# Altium schematic sheet Test Pour Over 1.SchDoc
size Tabloid; SheetNumber: 1; SheetTotal: 1; ENG_APP_DATE: --/--/--; DSN_APP_DATE: --/--/--; CHK_APP_DATE: --/--/--
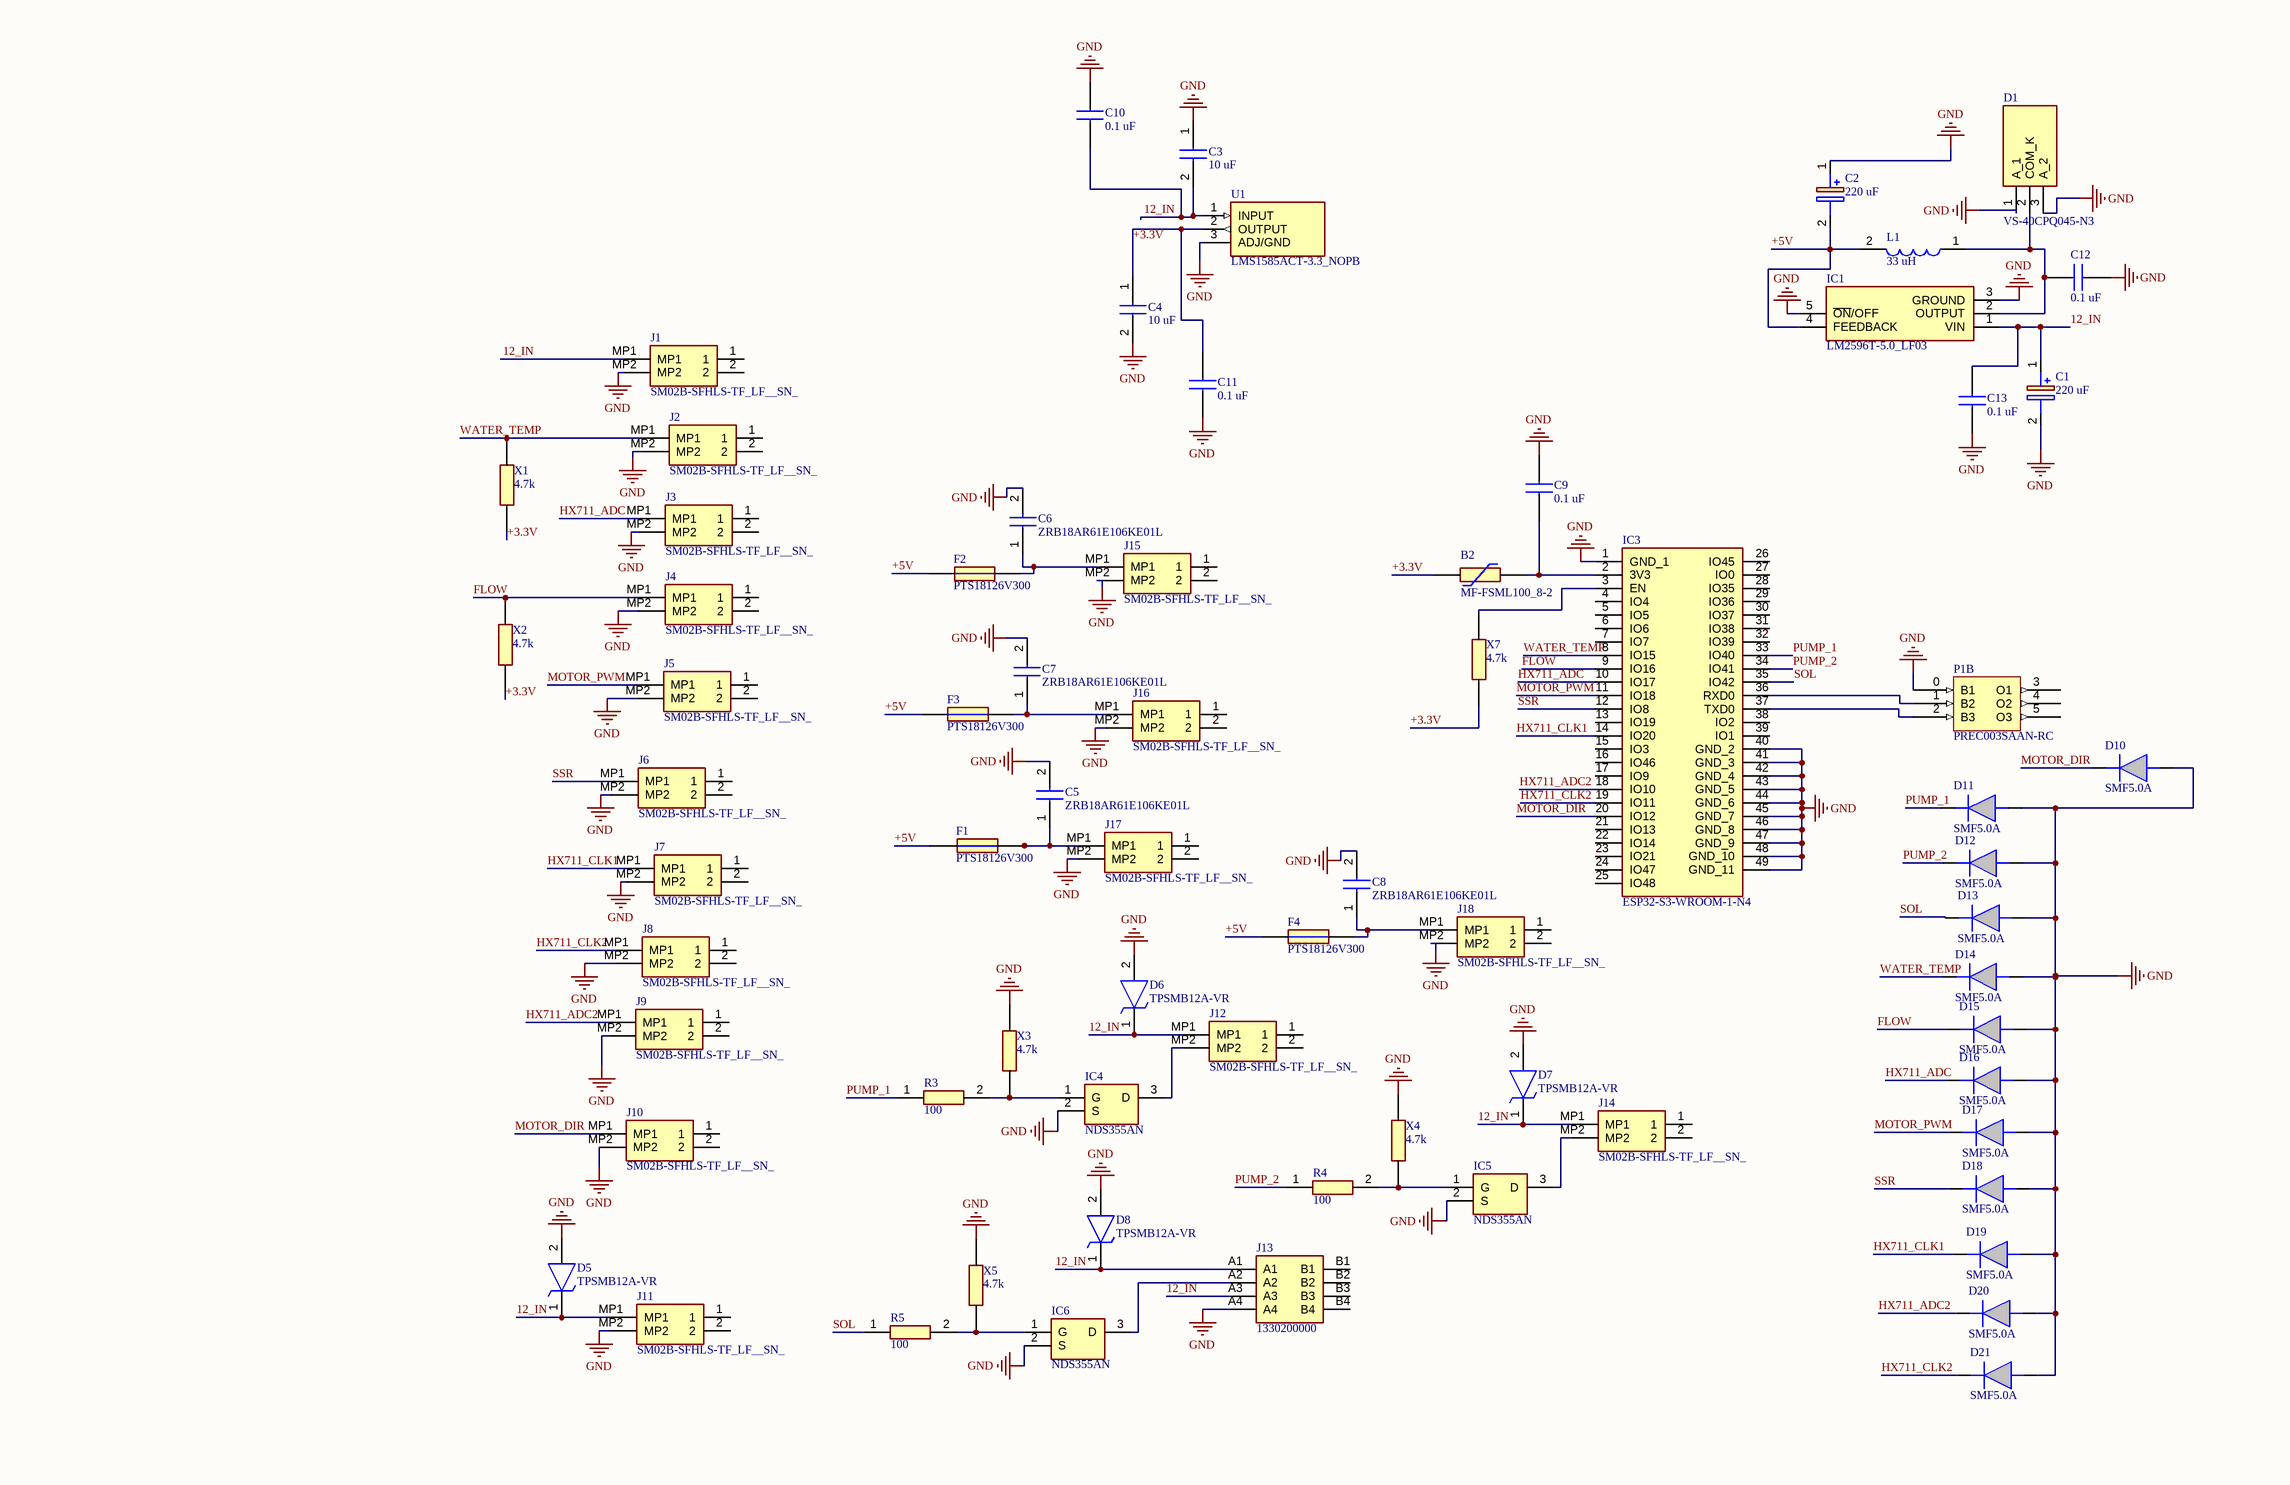
[diagram p0: Test Pour Over 1.SchDoc]

## Parts
B2  MF-FSML100_8-2  [FUSC1608X70N]
C1  220 uF  [EEHZT1E331UP]
C2  220 uF  [EEHZT1E331UP]
C3  10 uF  [ZRB18x]
C4  10 uF  [ZRB18x]
C5  ZRB18AR61E106KE01L  [ZRB18x]
C6  ZRB18AR61E106KE01L  [ZRB18x]
C7  ZRB18AR61E106KE01L  [ZRB18x]
C8  ZRB18AR61E106KE01L  [ZRB18x]
C9  0.1 uF  [CAPC2012X125N]
C10  0.1 uF  [CAPC2012X125N]
C11  0.1 uF  [CAPC2012X125N]
C12  0.1 uF  [CAPC2012X125N]
C13  0.1 uF  [CAPC2012X125N]
D1  VS-40CPQ045-N3  [TO546P531X1558X2499-3P]
D5  TPSMB12A-VR  [DIOM5436X244N]
D6  TPSMB12A-VR  [DIOM5436X244N]
D7  TPSMB12A-VR  [DIOM5436X244N]
D8  TPSMB12A-VR  [DIOM5436X244N]
D10  SMF5.0A  [SODFL3618X110N]
D11  SMF5.0A  [SODFL3618X110N]
D12  SMF5.0A  [SODFL3618X110N]
D13  SMF5.0A  [SODFL3618X110N]
D14  SMF5.0A  [SODFL3618X110N]
D15  SMF5.0A  [SODFL3618X110N]
D16  SMF5.0A  [SODFL3618X110N]
D17  SMF5.0A  [SODFL3618X110N]
D18  SMF5.0A  [SODFL3618X110N]
D19  SMF5.0A  [SODFL3618X110N]
D20  SMF5.0A  [SODFL3618X110N]
D21  SMF5.0A  [SODFL3618X110N]
F1  PTS18126V300  [FUSC4632X120N]
F2  PTS18126V300  [FUSC4632X120N]
F3  PTS18126V300  [FUSC4632X120N]
F4  PTS18126V300  [FUSC4632X120N]
IC1  LM2596T-5.0_LF03  [TO170P470X1028X2142-5P]
IC3  ESP32-S3-WROOM-1-N4  [ESP32S3WROOM1N4]
IC4  NDS355AN  [SOT95P251X112-3N]
IC5  NDS355AN  [SOT95P251X112-3N]
IC6  NDS355AN  [SOT95P251X112-3N]
J1  SM02B-SFHLS-TF_LF__SN_  [SM02BSFHLSTFLFSN]
J2  SM02B-SFHLS-TF_LF__SN_  [SM02BSFHLSTFLFSN]
J3  SM02B-SFHLS-TF_LF__SN_  [SM02BSFHLSTFLFSN]
J4  SM02B-SFHLS-TF_LF__SN_  [SM02BSFHLSTFLFSN]
J5  SM02B-SFHLS-TF_LF__SN_  [SM02BSFHLSTFLFSN]
J6  SM02B-SFHLS-TF_LF__SN_  [SM02BSFHLSTFLFSN]
J7  SM02B-SFHLS-TF_LF__SN_  [SM02BSFHLSTFLFSN]
J8  SM02B-SFHLS-TF_LF__SN_  [SM02BSFHLSTFLFSN]
J9  SM02B-SFHLS-TF_LF__SN_  [SM02BSFHLSTFLFSN]
J10  SM02B-SFHLS-TF_LF__SN_  [SM02BSFHLSTFLFSN]
J11  SM02B-SFHLS-TF_LF__SN_  [SM02BSFHLSTFLFSN]
J12  SM02B-SFHLS-TF_LF__SN_  [SM02BSFHLSTFLFSN]
J13  1330200000  [1330200000]
J14  SM02B-SFHLS-TF_LF__SN_  [SM02BSFHLSTFLFSN]
J15  SM02B-SFHLS-TF_LF__SN_  [SM02BSFHLSTFLFSN]
J16  SM02B-SFHLS-TF_LF__SN_  [SM02BSFHLSTFLFSN]
J17  SM02B-SFHLS-TF_LF__SN_  [SM02BSFHLSTFLFSN]
J18  SM02B-SFHLS-TF_LF__SN_  [SM02BSFHLSTFLFSN]
L1  33 uH  [INDPM8680X400N]
P1  PREC003SAAN-RC  [PCBComponent_1]  (part B of 2)
R3  100  [RESC2012X55N]
R4  100  [RESC2012X55N]
R5  100  [RESC2012X55N]
U1  LMS1585ACT-3.3_NOPB  [TO254P470X1028X1955-3P]
X1  4.7k  [RESC2012X65N]
X2  4.7k  [RESC2012X65N]
X3  4.7k  [RESC2012X65N]
X4  4.7k  [RESC2012X65N]
X5  4.7k  [RESC2012X65N]
X7  4.7k  [RESC2012X65N]

## Nets
GND: C1.2(-) C2.1(+) C3.1 C4.2 C5.2 C6.2 C7.2 C8.2 C9.1 C10.2 C11.1 C12.2 C13.1 D1.1(A_1) D1.3(A_2) D5.2(A) D6.2(A) D7.2(A) D8.2(A) D10.2(A) D11.2(A) D12.2(A) D13.2(A) D14.2(A) D15.2(A) D16.2(A) D17.2(A) D18.2(A) D19.2(A) D20.2(A) D21.2(A) IC1.3(GROUND) IC1.5(~{ON}/OFF) IC3.1(GND_1) IC3.40(GND_2) IC3.41(GND_3) IC3.42(GND_4) IC3.43(GND_5) IC3.44(GND_6) IC3.45(GND_7) IC3.46(GND_8) IC3.47(GND_9) IC3.48(GND_10) IC3.49(GND_11) IC4.2(S) IC5.2(S) IC6.2(S) J1.MP2 J2.MP2 J3.MP2 J4.MP2 J5.MP2 J6.MP2 J7.MP2 J8.MP2 J9.MP2 J10.MP2 J11.MP2 J13.A4 J15.MP2 J16.MP2 J17.MP2 J18.MP2 P1.0(B1) U1.3(ADJ/GND) X3.2 X4.2 X5.2
12_IN: C1.1(+) C3.2 C10.1 C13.2 D5.1(K) D6.1(K) D7.1(K) D8.1(K) IC1.1(VIN) J1.MP1 J11.MP1 J12.MP1 J13.A1 J13.A3 J14.MP1 U1.1(INPUT)
+3.3V: B2.1 C4.1 C11.2 U1.2(OUTPUT) X1.2 X2.2 X7.2
+5V: C2.2(-) F1.1 F2.1 F3.1 F4.1 IC1.4(FEEDBACK) L1.2
FLOW: D15.1(K) IC3.9(IO16) J4.MP1 X2.1
HX711_ADC: D16.1(K) IC3.10(IO17) J3.MP1
HX711_ADC2: D20.1(K) IC3.18(IO10) J9.MP1
HX711_CLK1: D19.1(K) IC3.14(IO20) J7.MP1
HX711_CLK2: D21.1(K) IC3.19(IO11) J8.MP1
MOTOR_DIR: D10.1(K) IC3.20(IO12) J10.MP1
MOTOR_PWM: D17.1(K) IC3.11(IO18) J5.MP1
PUMP_1: D11.1(K) IC3.33(IO40) R3.1
PUMP_2: D12.1(K) IC3.34(IO41) R4.1
SOL: D13.1(K) IC3.35(IO42) R5.1
SSR: D18.1(K) IC3.12(IO8) J6.MP1
WATER_TEMP: D14.1(K) IC3.8(IO15) J2.MP1 X1.1
NetB2_2: B2.2 C9.2 IC3.2(3V3)
NetC5_1: C5.1 F1.2 J17.MP1
NetC6_1: C6.1 F2.2 J15.MP1
NetC7_1: C7.1 F3.2 J16.MP1
NetC8_1: C8.1 F4.2 J18.MP1
NetC12_1: C12.1 D1.2(COM_K) IC1.2(OUTPUT) L1.1
NetIC3_3: IC3.3(EN) X7.1
NetIC3_36: IC3.36(RXD0) P1.1(B2)
NetIC3_37: IC3.37(TXD0) P1.2(B3)
NetIC4_1: IC4.1(G) R3.2 X3.1
NetIC4_3: IC4.3(D) J12.MP2
NetIC5_1: IC5.1(G) R4.2 X4.1
NetIC5_3: IC5.3(D) J14.MP2
NetIC6_1: IC6.1(G) R5.2 X5.1
NetIC6_3: IC6.3(D) J13.A2

Not connected (* = marked no-connect by the designer): IC3 4(IO4) 5(IO5) 6(IO6) 7(IO7) 13(IO19) 15(IO3) 16(IO46) 17(IO9) 21(IO13) 22(IO14) 23(IO21) 24(IO47) 25(IO48) 26(IO45) 27(IO0) 28(IO35) 29(IO36) 30(IO37) 31(IO38) 32(IO39) 38(IO2) 39(IO1); J1 1 2; J2 1 2; J3 1 2; J4 1 2; J5 1 2; J6 1 2; J7 1 2; J8 1 2; J9 1 2; J10 1 2; J11 1 2; J12 1 2; J13 B1 B2 B3 B4; J14 1 2; J15 1 2; J16 1 2; J17 1 2; J18 1 2; P1 3(O1) 4(O2) 5(O3)

## Notes on the sheet
- DWG. NO.
- REV.
- SHT.
- THIS DOCUMENT AND THE DATA DISCLOSED HEREIN OR HEREWITH IS THE PROPERTY OF ALTIUM LIMITED AND MAY BE FREELY DISTRIBUTED IN WHOLE. NO RIGHTS ARE RESERVED OR EXPRESS OR IMPLIED WARANTEE GIVEN.
- REVISION
- DESCRIPTION
- DATE
- APPROVED
- ENG:
- APPROVALS
- PROJECT
- DSN:
- CHK:
- REFERENCE DOCUMENTS
- PROJECT REVISION:
- TITLE
- DOCUMENT REVISION:
- DESIGN ITEM:
- BOM:
- FAB DWG:
- PCB DWG:
- ASSY DWG:
- SCALE:
- SIZE
- B
- CAGE CODE
- FILE NAME
- DWG NO.
- SHEET
- OF
- REV

## Library data of the parts
B2 = MF-FSML100_8-2: Resettable Fuses - PPTC 8V     1A; Manufacturer_Name: Bourns; Manufacturer_Part_Number: MF-FSML100/8-2; Geometry.Height: 0.7mm; Mouser Part Number: 652-MF-FSML100/8-2; Mouser Price/Stock: https://www.mouser.co.uk/ProductDetail/Bourns/MF-FSML100-8-2?qs=EBDBlbfErPzIwKpEUXHByQ%3D%3D; Datasheet Link: https://www.mouser.in/datasheet/2/54/bourns_05032019_MF-FSML-X_datasheet-1591429.pdf
C1 C2 = EEE-TP1C221AP: Capacitor Polarised; Manufacturer_Name: Panasonic; Datasheet Link: http://industrial.panasonic.com/cdbs/www-data/pdf/RDE0000/ABA0000C1196.pdf; Height: 10.8mm; Manufacturer_Part_Number: EEE-TP1C221AP; Mouser Part Number: 667-EEE-TP1C221AP; Mouser Price/Stock: https://www.mouser.com/Search/Refine.aspx?Keyword=667-EEE-TP1C221AP
C3 C4 = ZRB18AR61E106KE01L: Manufacturer_Name: Murata Electronics; Datasheet Link: https://search.murata.co.jp/Ceramy/image/img/A01X/G101/ENG/ZRB18AR61E106KE01-02A.pdf; Height: 1.2mm; Manufacturer_Part_Number: ZRB18AR61E106KE01L
C5-C8 = ZRB18AR61E106KE01L: Capacitor; Manufacturer_Name: Murata Electronics; Datasheet Link: https://search.murata.co.jp/Ceramy/image/img/A01X/G101/ENG/ZRB18AR61E106KE01-02A.pdf; Height: 1.2mm; Manufacturer_Part_Number: ZRB18AR61E106KE01L
C9-C13 = 885382207007: WCAP-CSST Soft Termination MLCC X7R0805104K050DFCT1S000; SMT Chip; 100 nF +/- 10%; 50 V(DC); -55C / +125C; size 0805; LxWxH 2.0 x 1.25 x 1.25; Term. Ag-Polymer/Ni/Sn; Manufacturer_Name: Wurth Elektronik; Geometry.Height: 1.25mm; Mouser Part Number: 710-885382207007; Mouser Price/Stock: https://www.mouser.co.uk/ProductDetail/Wurth-Elektronik/885382207007?qs=0lSvoLzn4L%2FSz5irZYcG7Q%3D%3D; Manufacturer_Part_Number: 885382207007; Datasheet Link: https://www.we-online.com/catalog/datasheet/885382207007.pdf
D1 = VS-40CPQ045-N3: Diode; Manufacturer_Name: Vishay; Datasheet Link: https://www.vishay.com/docs/96456/vs-40cpq-n3series.pdf; Height: 5.31mm; Manufacturer_Part_Number: VS-40CPQ045-N3; Mouser Part Number: 78-VS-40CPQ045-N3; Mouser Price/Stock: https://www.mouser.com/Search/Refine.aspx?Keyword=78-VS-40CPQ045-N3
D5-D8 = TPSMB12A-VR: TVS Diode (Uni-directional); Manufacturer_Name: LITTELFUSE; Datasheet Link: http://www.littelfuse.com/~/media/electronics/datasheets/tvs_diodes/littelfuse_tvs_diode_tpsmb_vr_datasheet.pdf.pdf; Height: 2.44mm; Manufacturer_Part_Number: TPSMB12A-VR; Mouser Part Number: 576-TPSMB12A-VR; Mouser Price/Stock: https://www.mouser.co.uk/ProductDetail/Littelfuse/TPSMB12A-VR?qs=AQlKX63v8RvODBvNBGUrbg%3D%3D; Arrow Part Number: TPSMB12A-VR; Arrow Price/Stock: https://www.arrow.com/en/products/tpsmb12a-vr/littelfuse?region=europe
D10-D21 = SMF5.0A: LITTELFUSE - SMF5.0A - TVS DIODE, 200W, 5V, UNIDIR, SOD-123FL; Geometry.Height: 1.1mm; Mouser Part Number: 576-SMF5.0A; Mouser Price/Stock: https://www.mouser.co.uk/ProductDetail/Littelfuse/SMF5.0A?qs=w7s0xA%252BTU%2FHYt6%2FEHP8V9g%3D%3D; Manufacturer_Name: LITTELFUSE; Manufacturer_Part_Number: SMF5.0A; Datasheet Link: https://componentsearchengine.com/Datasheets/2/SMF5.0A.pdf
F1-F4 = PTS18126V300: PPTC SMD 1812 6V 3.0A; Manufacturer_Name: Eaton; Geometry.Height: 1.2mm; Mouser Part Number: 504-PTS18126V300; Mouser Price/Stock: https://www.mouser.co.uk/ProductDetail/Eaton-Electronics/PTS18126V300?qs=QmibqUXyDhQSUADtV47rkw%3D%3D; Manufacturer_Part_Number: PTS18126V300; Datasheet Link: https://www.eaton.com/content/dam/eaton/products/electronic-components/resources/data-sheet/eaton-pts1812-6-60-volt-dc-surface-mount-resettable-ptc-data-sheet.pdf
IC1 = LM2596T-5.0_LF03: Integrated Circuit; Manufacturer_Name: Texas Instruments; Manufacturer_Part_Number: LM2596T-5.0/LF03; Datasheet Link: https://www.ti.com/lit/ds/symlink/lm2596.pdf?ts=1607069798907&ref_url=https%253A%252F%252Fwww.ti.com%252Fstore%252Fti%252Fen%252Fp%252Fproduct%252F%253Fp%253DLM2596T-5.0%252FLF03%2526keyMatch%253DLM2596T-5.0%252FLF03%2526tisearch%253DSearch-EN-everything%; Height: 4.7mm; Mouser Part Number: 926-LM2596T-50/LF03; Mouser Price/Stock: https://www.mouser.co.uk/ProductDetail/Texas-Instruments/LM2596T-5.0-LF03?qs=X1J7HmVL2ZG6KM98hB9zGA%3D%3D; Arrow Part Number: LM2596T-5.0/LF03; Arrow Price/Stock: https://www.arrow.com/en/products/lm2596t-5.0lf03/texas-instruments?utm_currency=USD&region=nac
IC3 = ESP32-S3-WROOM-1-N4: Integrated Circuit; Manufacturer_Name: Espressif Systems; Datasheet Link: https://www.espressif.com/sites/default/files/documentation/esp32-s3-wroom-1_wroom-1u_datasheet_en.pdf; Height: 3.25mm; Manufacturer_Part_Number: ESP32-S3-WROOM-1-N4; Mouser Part Number: 356-ESP32-S3WROOM1N4; Mouser Price/Stock: https://www.mouser.co.uk/ProductDetail/Espressif-Systems/ESP32-S3-WROOM-1-N4?qs=Li%252BoUPsLEnsO%2FkiJOUK0FQ%3D%3D
IC4-IC6 = NDS355AN: Integrated Circuit; Manufacturer_Name: onsemi; Datasheet Link: https://www.onsemi.com/pub/Collateral/NDS355AN-D.PDF; Height: 1.12mm; Manufacturer_Part_Number: NDS355AN; Mouser Part Number: 512-NDS355AN; Mouser Price/Stock: https://www.mouser.co.uk/ProductDetail/onsemi-Fairchild/NDS355AN?qs=FOlmdCx%252BAA0yQlAVFAsL8w%3D%3D; Arrow Part Number: NDS355AN; Arrow Price/Stock: https://www.arrow.com/en/products/nds355an/on-semiconductor?utm_currency=USD&region=europe
J1-J12 J14-J18 = SM02B-SFHLS-TF_LF__SN_: CONN HEADER SMD R/A 2POS 1.8MM; Manufacturer_Name: JST (JAPAN SOLDERLESS TERMINALS); Manufacturer_Part_Number: SM02B-SFHLS-TF(LF)(SN); Geometry.Height: 3mm; Datasheet Link: *; Mouser Part Number: 306-SM02BSFHLSTFLFSN; Mouser Price/Stock: https://www.mouser.co.uk/ProductDetail/JST-Commercial/SM02B-SFHLS-TFLFSN?qs=QpmGXVUTftEFVlI2shSw8Q%3D%3D
J13 = 1330200000: Connector; Manufacturer_Name: Weidmuller; Datasheet Link: https://datasheet.weidmueller.com/pdf/en/1330200000/scope/2/; Height: 19.2mm; Manufacturer_Part_Number: 1330200000; Mouser Part Number: 470-1330200000; Mouser Price/Stock: https://www.mouser.co.uk/ProductDetail/Weidmuller/1330200000?qs=WJDKaGZ8K%252B5Dx5GLcU%2Fbhw%3D%3D
L1 = F1F2-0804-330M: Inductor; Manufacturer_Name: Bel; Datasheet Link: https://www.mouser.in/datasheet/3/191/1/ds-ST-F1F2-0804-series.pdf; Height: 4mm; Manufacturer_Part_Number: F1F2-0804-330M
P1 = PREC003SAAN-RC: ESP32 USB Connector
R3-R5 = TNPW0805100RBEEA: Resistor; Manufacturer_Name: Vishay; Datasheet Link: http://www.vishay.com/docs/31006/tnpw.pdf; Height: 0.55mm; Manufacturer_Part_Number: TNPW0805100RBEEA; Mouser Part Number: 71-TNPW0805100RBEEA; Mouser Price/Stock: https://www.mouser.co.uk/ProductDetail/Vishay-Dale/TNPW0805100RBEEA?qs=CqEPuS5aiX%2FTdzUNace1OQ%3D%3D; Arrow Part Number: TNPW0805100RBEEA; Arrow Price/Stock: https://www.arrow.com/en/products/tnpw0805100rbeea/vishay?region=nac
U1 = LMS1585ACT-3.3_NOPB: Undefined or Miscellaneous; Manufacturer_Name: Texas Instruments; Manufacturer_Part_Number: LMS1585ACT-3.3/NOPB; Datasheet Link: http://www.ti.com/lit/gpn/lms1585a; Height: 4.7mm; Mouser Part Number: 926-LMS1585ACT33NOPB; Mouser Price/Stock: https://www.mouser.co.uk/ProductDetail/Texas-Instruments/LMS1585ACT-3.3-NOPB?qs=7lkVKPoqpbYfezQINhjreg%3D%3D; Arrow Part Number: LMS1585ACT-3.3/NOPB; Arrow Price/Stock: https://www.arrow.com/en/products/lms1585act-3.3nopb/texas-instruments?region=nac
X1-X5 X7 = CPF0805B4K7E1: Manufacturer_Name: TE Connectivity; Geometry.Height: 0.65mm; Mouser Part Number: 279-CPF0805B4K7E1; Mouser Price/Stock: https://www.mouser.co.uk/ProductDetail/TE-Connectivity-Holsworthy/CPF0805B4K7E1?qs=8G8kQhBkhGiesIpPd19ZrQ%3D%3D; Manufacturer_Part_Number: CPF0805B4K7E1; Datasheet Link: https://www.te.com/commerce/DocumentDelivery/DDEController?Action=srchrtrv&DocNm=8-1773459-4_ELEVATOR_ESCALATOR_SOLUTIONS&DocType=Data%20Sheet&DocLang=English&PartCntxt=7-1614884-6&DocFormat=pdf